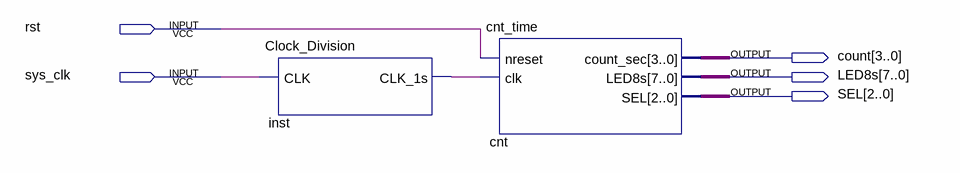
[diagram p0: schematic sheet]
// Quartus schematic tst2.bdf as structural Verilog: 2 symbols, 5 pins
module tst2 (
  input  rst,
  input  sys_clk,
  output [3:0] count,
  output [7:0] LED8s,
  output [2:0] SEL
);

  wire inst_clk_1s;

  Clock_Division inst (.CLK(sys_clk), .CLK_1s(inst_clk_1s));
  cnt_time cnt (.nreset(rst), .clk(inst_clk_1s), .count_sec(count), .LED8s(LED8s), .SEL(SEL));
endmodule
